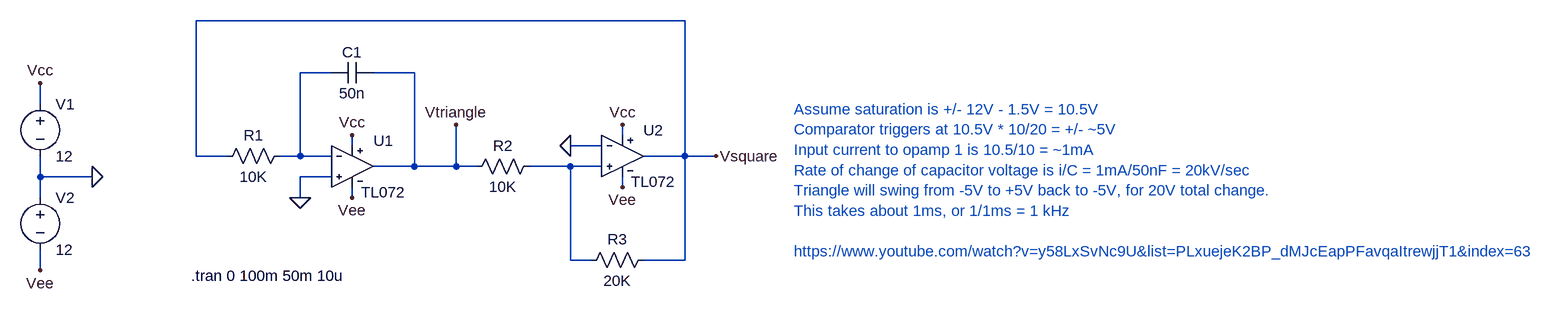
[diagram p0: schematic triangle_square_generator.asc]
triangle_square_generator.asc, the LTspice schematic file:
Version 4
SHEET 1 2620 680
WIRE 1184 -144 432 -144
WIRE 640 -64 592 -64
WIRE 768 -64 704 -64
WIRE 192 -16 192 -48
WIRE 1088 32 1088 16
WIRE 672 48 672 32
WIRE 1056 48 1008 48
WIRE 432 64 432 -144
WIRE 480 64 432 64
WIRE 592 64 592 -64
WIRE 592 64 560 64
WIRE 640 64 592 64
WIRE 1184 64 1184 -144
WIRE 1184 64 1120 64
WIRE 1232 64 1184 64
WIRE 768 80 768 -64
WIRE 768 80 704 80
WIRE 832 80 832 16
WIRE 832 80 768 80
WIRE 864 80 832 80
WIRE 1008 80 944 80
WIRE 1056 80 1008 80
WIRE 192 96 192 64
WIRE 272 96 192 96
WIRE 640 96 592 96
WIRE 1088 112 1088 96
WIRE 192 128 192 96
WIRE 592 128 592 96
WIRE 672 128 672 112
WIRE 1008 224 1008 80
WIRE 1040 224 1008 224
WIRE 1184 224 1184 64
WIRE 1184 224 1120 224
WIRE 192 240 192 208
FLAG 192 -48 Vcc
FLAG 272 96 0
FLAG 192 240 Vee
FLAG 672 32 Vcc
FLAG 1088 16 Vcc
FLAG 672 128 Vee
FLAG 1088 112 Vee
FLAG 1008 48 0
FLAG 832 16 Vtriangle
FLAG 1232 64 Vsquare
FLAG 592 128 0
SYMBOL voltage 192 -32 R0
SYMATTR InstName V1
SYMATTR Value 12
SYMBOL voltage 192 112 R0
SYMATTR InstName V2
SYMATTR Value 12
SYMBOL TL072 672 80 R0
SYMATTR InstName U1
SYMBOL TL072 1088 64 R0
SYMATTR InstName U2
SYMBOL res 576 48 R90
WINDOW 0 0 56 VBottom 2
WINDOW 3 32 56 VTop 2
SYMATTR InstName R1
SYMATTR Value 10K
SYMBOL cap 704 -80 R90
WINDOW 0 0 32 VBottom 2
WINDOW 3 32 32 VTop 2
SYMATTR InstName C1
SYMATTR Value 50n
SYMBOL res 960 64 R90
WINDOW 0 0 56 VBottom 2
WINDOW 3 32 56 VTop 2
SYMATTR InstName R2
SYMATTR Value 10K
SYMBOL res 1136 208 R90
WINDOW 0 0 56 VBottom 2
WINDOW 3 32 56 VTop 2
SYMATTR InstName R3
SYMATTR Value 20K
TEXT 424 248 Left 2 !.tran 0 100m 50m 10u
TEXT 1352 -8 Left 2 ;Assume saturation is +/- 12V - 1.5V = 10.5V\nComparator triggers at 10.5V * 10/20 = +/- ~5V\nInput current to opamp 1 is 10.5/10 = ~1mA\nRate of change of capacitor voltage is i/C = 1mA/50nF = 20kV/sec\nTriangle will swing from -5V to +5V back to -5V, for 20V total change.\nThis takes about 1ms, or 1/1ms = 1 kHz\n \nhttps://www.youtube.com/watch?v=y58LxSvNc9U&list=PLxuejeK2BP_dMJcEapPFavqaItrewjjT1&index=63

The netlist it stands for:
* triangle_square_generator.asc
V1 Vcc 0 12
V2 0 Vee 12
XU1 0 N001 Vcc Vee Vtriangle TL072  ; pins 1 2 3 4 5
XU2 N002 0 Vcc Vee Vsquare TL072  ; pins 1 2 3 4 5
R1 N001 Vsquare 10K
C1 Vtriangle N001 50n
R2 N002 Vtriangle 10K
R3 Vsquare N002 20K
.tran 0 100m 50m 10u
* Assume saturation is +/- 12V - 1.5V = 10.5V
* Comparator triggers at 10.5V * 10/20 = +/- ~5V
* Input current to opamp 1 is 10.5/10 = ~1mA
* Rate of change of capacitor voltage is i/C = 1mA/50nF = 20kV/sec
* Triangle will swing from -5V to +5V back to -5V, for 20V total change.
* This takes about 1ms, or 1/1ms = 1 kHz
* https://www.youtube.com/watch?v=y58LxSvNc9U&list=PLxuejeK2BP_dMJcEapPFavqaItrewjjT1&index=63
.lib D:\git-repos\LTSpice-Projects\TL072\TL072.lib
.backanno
.end